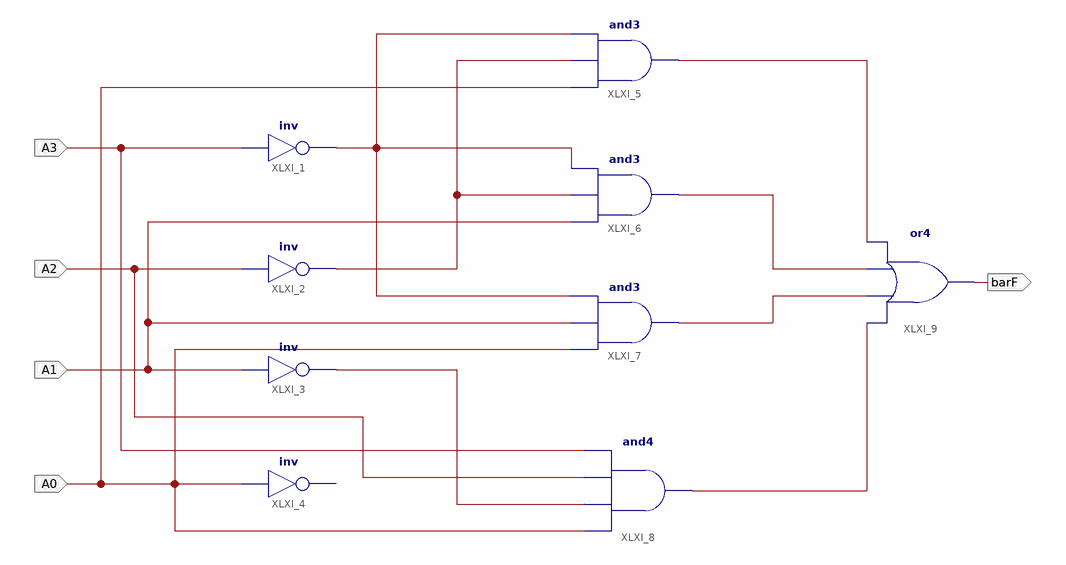
[diagram p0: schematic sheet 1]
// Xilinx ISE schematic fnd6.sch (spartan6) as structural Verilog: 9 symbols, 5 ports
module fnd6 (
  input  A3,
  input  A2,
  input  A1,
  input  A0,
  output barF
);

  wire XLXN_9, XLXN_10, XLXN_16, XLXN_18, XLXN_19, XLXN_20, XLXN_21;

  not XLXI_1 (XLXN_9, A3);
  not XLXI_2 (XLXN_10, A2);
  not XLXI_3 (XLXN_16, A1);
  // inv XLXI_4 has open pins: I=A0, O=open
  and XLXI_5 (XLXN_18, A0, XLXN_10, XLXN_9);
  and XLXI_6 (XLXN_19, A1, XLXN_10, XLXN_9);
  and XLXI_7 (XLXN_20, A0, A1, XLXN_9);
  and XLXI_8 (XLXN_21, A0, XLXN_16, A2, A3);
  or XLXI_9 (barF, XLXN_21, XLXN_20, XLXN_19, XLXN_18);
endmodule
